# EAGLE design uHexV1_pub (EAGLE 7.2.0)
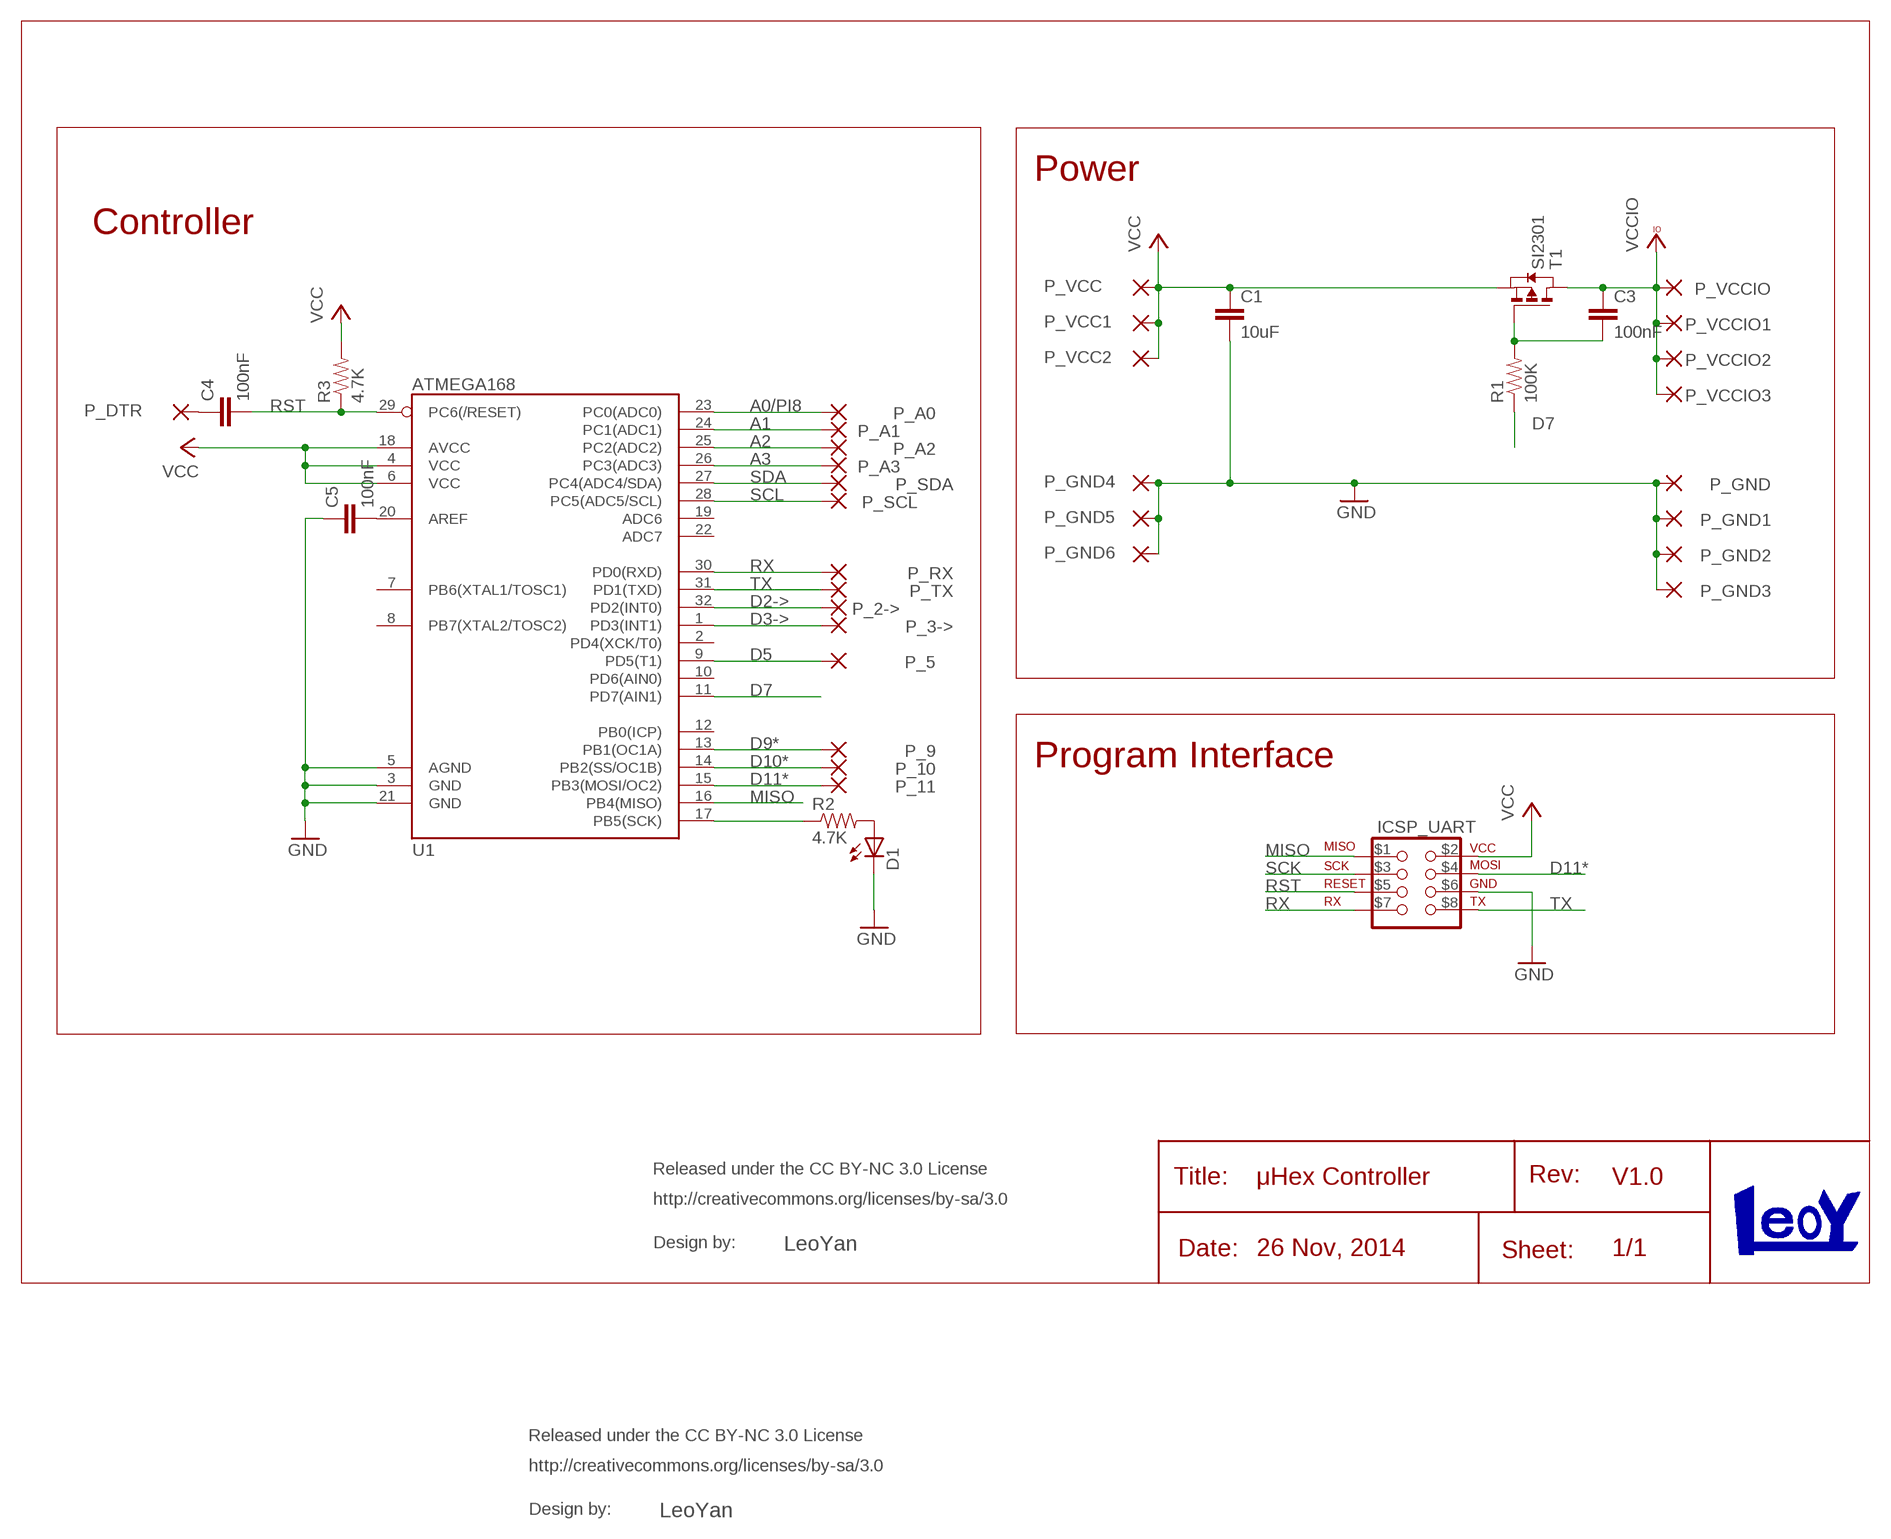
[diagram p0: schematic, sheet 1]

## Parts
C1  10uF  C-EUC0603K  [C0603K]
C3  100nF  C-EUC0603K  [C0603K]
C4  100nF  C-EUC0603K  [C0603K]
C5  100nF  C-EUC0603K  [C0603K]
D1  LED-YELLOW0603  [LED-0603]
ICSP_UART  ICSP_UART_CONNICSP_UAST_HOLE  [ICSP_UART_CONN_HOLE]
P_2->  TH-PAD2.54M01_TH_OFFSET  [TH_PAD_OFFSET]
P_3->  TH-PAD2.54M01_TH_OFFSET  [TH_PAD_OFFSET]
P_5  TH-PAD2.54M01_TH_HORN  [TH_PAD_HORN]
P_9  TH-PAD2.54M01_TH_OFFSET  [TH_PAD_OFFSET]
P_10  TH-PAD2.54M01_TH_OFFSET  [TH_PAD_OFFSET]
P_11  TH-PAD2.54M01_TH_HORN  [TH_PAD_HORN]
P_A0  TH-PAD2.54M01_TH_HORN  [TH_PAD_HORN]
P_A1  TH-PAD2.54M01_TH_OFFSET  [TH_PAD_OFFSET]
P_A2  TH-PAD2.54M01_TH_OFFSET  [TH_PAD_OFFSET]
P_A3  TH-PAD2.54M01_TH_HORN  [TH_PAD_HORN]
P_DTR  TH-PAD2.54MO1_TH_DTR  [TH_PAD_DTR]
P_GND  TH-PAD2.54M01_TH_PWR  [TH_PAD_PWR]
P_GND1  TH-PAD2.54OFFSET  [TH_PAD_PWR_OFFSET]
P_GND2  TH-PAD2.54OFFSET  [TH_PAD_PWR_OFFSET]
P_GND3  TH-PAD2.54OFFSET  [TH_PAD_PWR_OFFSET]
P_GND4  TH-PAD2.54OFFSET  [TH_PAD_PWR_OFFSET]
P_GND5  TH-PAD2.54OFFSET  [TH_PAD_PWR_OFFSET]
P_GND6  TH-PAD2.54OFFSET  [TH_PAD_PWR_OFFSET]
P_RX  TH-PAD2.54M01_TH_OFFSET  [TH_PAD_OFFSET]
P_SCL  TH-PAD2.54M01_TH_OFFSET  [TH_PAD_OFFSET]
P_SDA  TH-PAD2.54M01_TH_OFFSET  [TH_PAD_OFFSET]
P_TX  TH-PAD2.54M01_TH_OFFSET  [TH_PAD_OFFSET]
P_VCC  TH-PAD2.54OFFSET  [TH_PAD_PWR_OFFSET]
P_VCC1  TH-PAD2.54M01_TH_PWR  [TH_PAD_PWR]
P_VCC2  TH-PAD2.54OFFSET  [TH_PAD_PWR_OFFSET]
P_VCCIO  TH-PAD2.54OFFSET  [TH_PAD_PWR_OFFSET]
P_VCCIO1  TH-PAD2.54OFFSET  [TH_PAD_PWR_OFFSET]
P_VCCIO2  TH-PAD2.54OFFSET  [TH_PAD_PWR_OFFSET]
P_VCCIO3  TH-PAD2.54OFFSET  [TH_PAD_PWR_OFFSET]
R1  100K  RESISTOR0603-RES  [0603-RES]
R2  4.7K  RESISTOR0603-RES  [0603-RES]
R3  4.7K  RESISTOR0603-RES  [0603-RES]
T1  SI2301  PMOSSOT23  [SOT-23]
U1  ATMEGA168  [TQFP32-08]

## Nets
A0/PI8: P_A0.1(P$) U1.23(PC0(ADC0))
A1: P_A1.P$1(P$) U1.24(PC1(ADC1))
A2: P_A2.P$1(P$) U1.25(PC2(ADC2))
A3: P_A3.1(P$) U1.26(PC3(ADC3))
D2->: P_2->.P$1(P$) U1.32(PD2(INT0))
D3->: P_3->.P$1(P$) U1.1(PD3(INT1))
D5: P_5.1(P$) U1.9(PD5(T1))
D7: R1.1 U1.11(PD7(AIN1))
D9*: P_9.P$1(P$) U1.13(PB1(OC1A))
D10*: P_10.P$1(P$) U1.14(PB2(SS/OC1B))
D11*: ICSP_UART.$4 P_11.1(P$) U1.15(PB3(MOSI/OC2))
GND [Power]: C1.2 C5.1 D1.C ICSP_UART.$6 P_GND1.P$1(P$) P_GND2.P$1(P$) P_GND3.P$1(P$) P_GND4.P$1(P$) P_GND5.P$1(P$) P_GND6.P$1(P$) P_GND.P$1(P$) U1.3(GND) U1.5(AGND) U1.21(GND)
MISO: ICSP_UART.$1 U1.16(PB4(MISO))
N$1: D1.A R2.2
N$4: C3.2 R1.2 T1.3(G)
N$6: C4.1 P_DTR.1(P$)
N$8: C5.2 U1.20(AREF)
RST: C4.2 ICSP_UART.$5 R3.1 U1.29(PC6(/RESET))
RX: ICSP_UART.$7 P_RX.P$1(P$) U1.30(PD0(RXD))
SCK: ICSP_UART.$3 R2.1 U1.17(PB5(SCK))
SCL: P_SCL.P$1(P$) U1.28(PC5(ADC5/SCL))
SDA: P_SDA.P$1(P$) U1.27(PC4(ADC4/SDA))
TX: ICSP_UART.$8 P_TX.P$1(P$) U1.31(PD1(TXD))
VCC [Power]: C1.1 ICSP_UART.$2 P_VCC1.P$1(P$) P_VCC2.P$1(P$) P_VCC.P$1(P$) R3.2 T1.2(S) U1.4(VCC) U1.6(VCC) U1.18(AVCC)
VCCIO [Power]: C3.1 P_VCCIO1.P$1(P$) P_VCCIO2.P$1(P$) P_VCCIO3.P$1(P$) P_VCCIO.P$1(P$) T1.1(D)
Unconnected: U1.2(PD4(XCK/T0)) U1.7(PB6(XTAL1/TOSC1)) U1.8(PB7(XTAL2/TOSC2)) U1.10(PD6(AIN0)) U1.12(PB0(ICP)) U1.19(ADC6) U1.22(ADC7)

## Notes on the sheet
- Power
- Controller
- Program Interface
- μHex Controller | V1.0
- 26 Nov, 2014 | 1/1

## Library data of the parts
C1 = resistor:C-EU: CAPACITOR, European symbol
C3-C5 = rcl:C-EU: CAPACITOR, European symbol
D1 = SparkFun-LED:LED-YELLOW: Yellow SMD LEDs LilyPad 1206- DIO-09909 0603- DIO-09003; PROD_ID: DIO-09003
ICSP_UART = LeoYan:ICSP_UART_CONN
P_2-> P_3-> P_5 P_9-P_11 P_A0 P_A1-P_A3 P_DTR P_GND P_GND1-P_GND6 P_RX P_SCL P_SDA P_TX P_VCC P_VCC1 P_VCC2 P_VCCIO P_VCCIO1-P_VCCIO3 = LeoBuild:TH-PAD2.54
R1-R3 = SparkFun-Passives:RESISTOR: Resistor Basic schematic elements and footprints for 0603, 1206, and PTH resistors.
T1 = zetex:PMOSSOT23: MOS FET; OC_FARNELL: unknown; OC_NEWARK: unknown
U1 = SparkFun-DigitalIC:ATMEGA168: Atmel 32-pin 8-bit micro, 16k flash.

## Net classes
0 default: width 0.254 mm, drill 0.356 mm, clearance 0.254 mm
1 Power: width 0.406 mm, drill 0.356 mm, clearance 0.305 mm

## Board
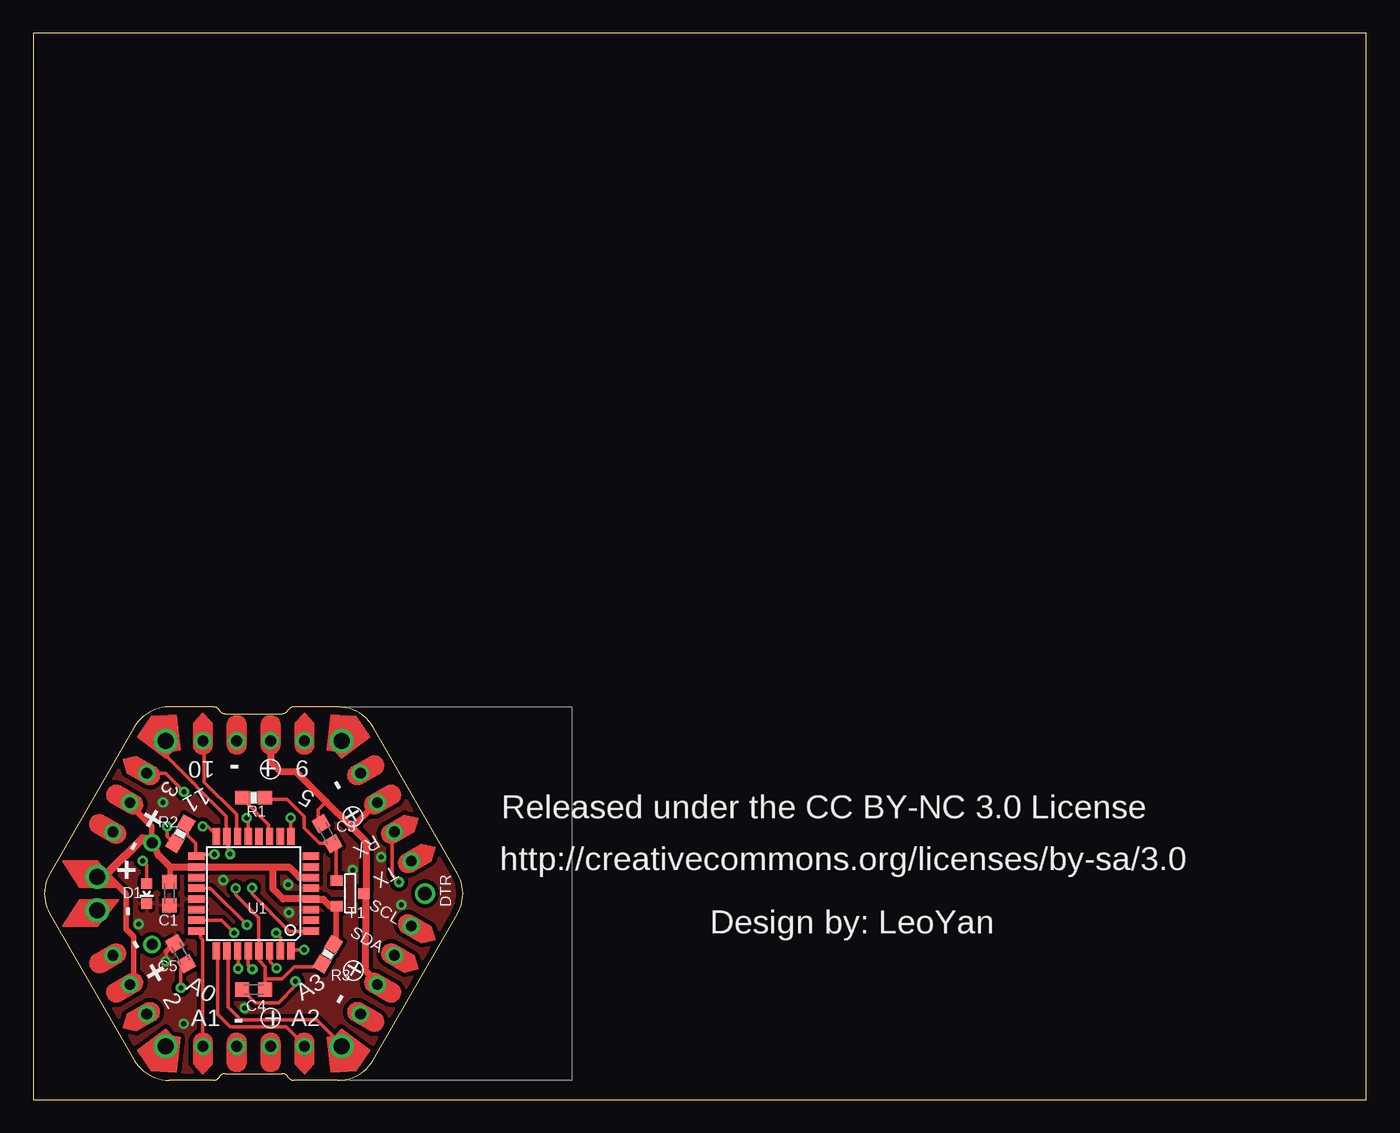
[diagram p1: board, top side]
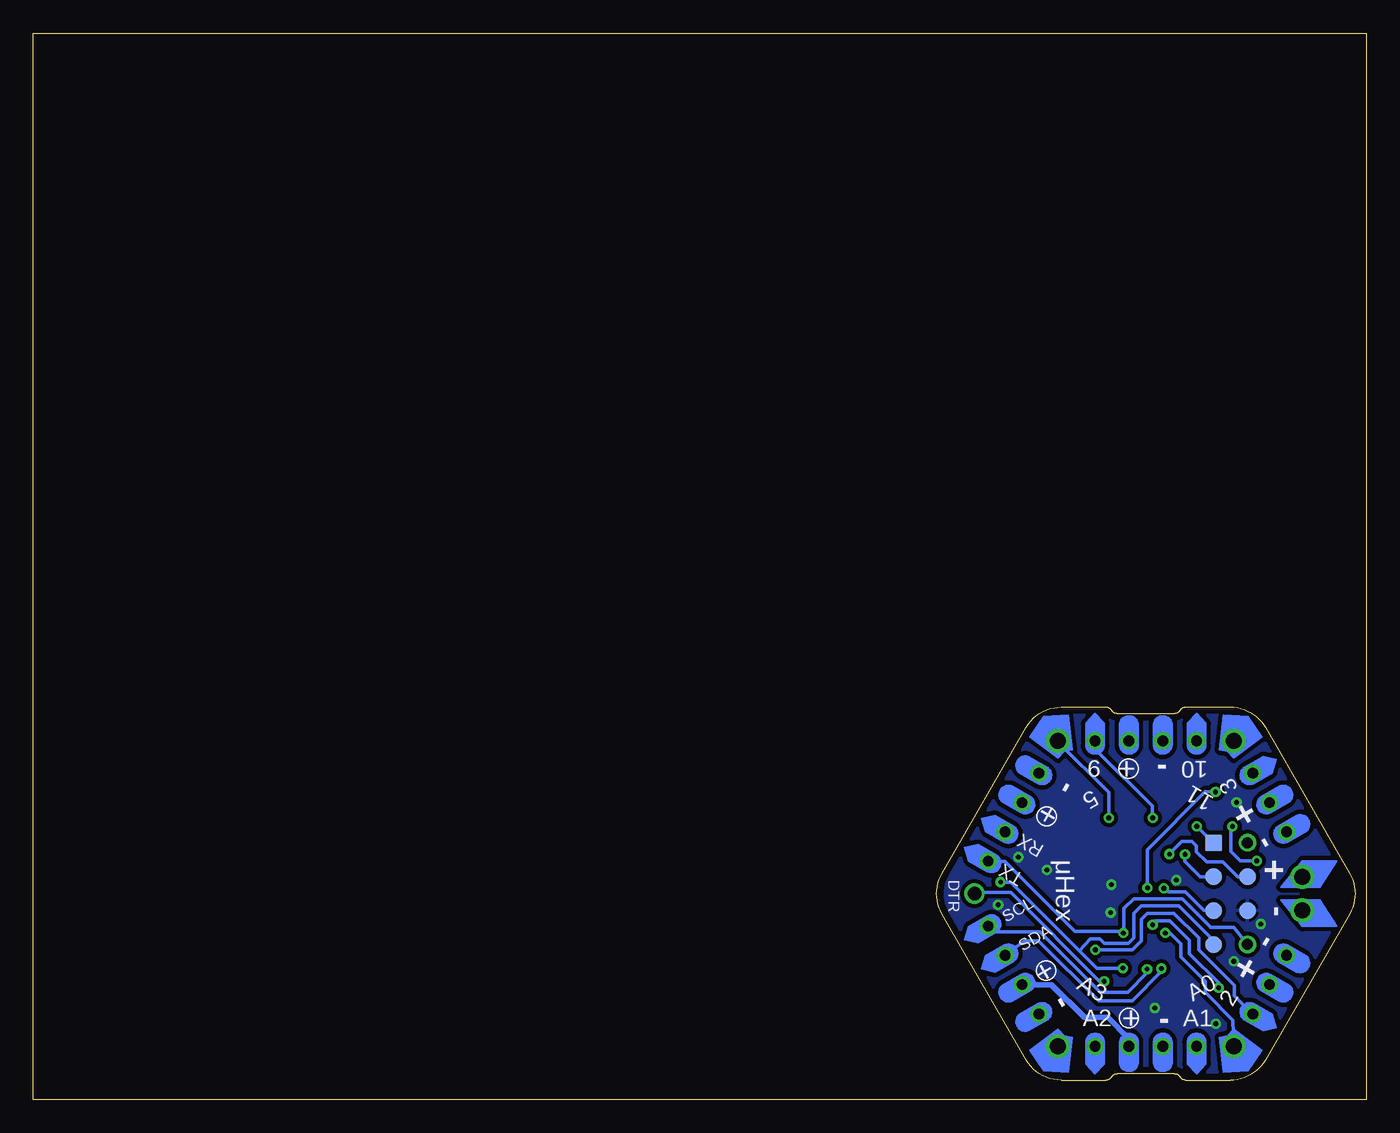
[diagram p2: board, bottom side, seen from below]

Size 100 x 80 mm. Coordinates in mm from the lower left corner, seen from the top.
Outline: 0,0 100,0 100,80 0,80 0,0
Outline: 14.4,28.95 18.66,28.95 arc60 19.1,29.2 arc-60 19.53,29.45 22.88,29.45 arc-60 25.48,27.95 31.83,16.95 arc-60 31.83,13.95 25.48,2.95 arc-60 22.88,1.45 19.53,1.45 arc-60 19.1,1.7 arc60 18.66,1.95 14.4,1.95 arc60 13.96,1.7 arc-60 13.53,1.45 10.18,1.45 arc-60 7.58,2.95 1.23,13.95 arc-60 1.23,16.95 7.58,27.95 arc-60 10.18,29.45 13.53,29.45 arc-60 13.96,29.2 arc60 14.4,28.95
Copper layers (1*16): Top 0.035mm / dielectric 1.5mm / Bottom 0.035mm
Design rules "default *": minimum track width 10mil, minimum drill 14mil, track to track 10mil, track to pad 10mil, pad to pad 10mil, via to via 10mil, smd to smd 10mil, copper to edge 20mil, drill to drill 8mil, minimum pad ring 10mil, minimum via ring 8mil, stop-mask expansion 4mil, vias tented up to drill 16mil, thermal gap 10mil

### Footprints (pad centres in the part's own frame; a part is rotated, then mirrored left to right if it is on the bottom)
C0603K = smd 1.05 x 1.08: 1 -0.875,0; 2 0.875,0
LED-0603 = smd 0.8 x 0.8: A 0,-0.75; C 0,0.75
ICSP_UART_CONN_HOLE = smd 1.27 x 1.27: $1 -1.27,3.81; $3 -1.27,1.27; $4 1.27,1.27; $5 -1.27,-1.27; $6 1.27,-1.27; $7 -1.27,-3.81 | drill 0.8 pad 1.2: $2 1.27,3.81; $8 1.27,-3.81
TH_PAD_OFFSET = drill 0.8: P$1 0,0
TH_PAD_HORN = drill 1.2: 1 0,0
TH_PAD_DTR = drill 1: 1 0,0
TH_PAD_PWR = drill 1.2: P$1 0,0
TH_PAD_PWR_OFFSET = drill 0.8: P$1 0,0
0603-RES = smd 1.1 x 1: 1 -0.85,0; 2 0.85,0
SOT-23 = smd 0.787 x 0.889: 1 0.025,-1.016; 2 -0.94,1.016; 3 0.991,1.016
TQFP32-08 = smd 1.27 x 0.559: 1 -4.293,2.8; 2 -4.293,2; 3 -4.293,1.2; 4 -4.293,0.4; 5 -4.293,-0.4; 6 -4.293,-1.2; 7 -4.293,-2; 8 -4.293,-2.8; 17 4.293,-2.8; 18 4.293,-2; 19 4.293,-1.2; 20 4.293,-0.4; 21 4.293,0.4; 22 4.293,1.2; 23 4.293,2; 24 4.293,2.8 | smd 0.559 x 1.27: 9 -2.8,-4.293; 10 -2,-4.293; 11 -1.2,-4.293; 12 -0.4,-4.293; 13 0.4,-4.293; 14 1.2,-4.293; 15 2,-4.293; 16 2.8,-4.293; 25 2.8,4.293; 26 2,4.293; 27 1.2,4.293; 28 0.4,4.293; 29 -0.4,4.293; 30 -1.2,4.293; 31 -2,4.293; 32 -2.8,4.293

### Placement (x,y rotation side)
C1  10.2,15.45 270 top
C3  22.03,19.95 300 top
C4  16.53,8.25 0 top
C5  11.05,10.95 300 top
D1  8.5,15.46 180 top
ICSP_UART  10.18,15.45 0 bottom
P_2->  8.51,6.42 210 top
P_3->  8.51,24.48 150 top
P_5  23.15,26.91 330 top
P_9  20.34,26.91 90 top
P_10  12.72,26.91 90 top
P_11  9.91,26.91 30 top
P_A0  9.91,3.99 150 top
P_A1  12.72,3.99 270 top
P_A2  20.34,3.99 270 top
P_A3  23.15,3.99 210 top
P_DTR  29.38,15.45 270 top
P_GND  4.79,14.18 90 top
P_GND1  15.26,3.99 270 top
P_GND2  5.97,10.82 210 top
P_GND3  24.55,6.42 330 top
P_GND4  24.55,24.48 30 top
P_GND5  15.26,26.91 90 top
P_GND6  5.97,20.08 150 top
P_RX  27.09,20.08 30 top
P_SCL  28.36,13.02 330 top
P_SDA  27.09,10.82 330 top
P_TX  28.36,17.88 30 top
P_VCC  7.24,8.62 210 top
P_VCC1  4.79,16.72 270 bottom
P_VCC2  7.24,22.28 150 top
P_VCCIO  17.8,3.99 270 top
P_VCCIO1  25.82,8.62 330 top
P_VCCIO2  25.82,22.28 30 top
P_VCCIO3  17.8,26.91 90 top
R1  16.53,22.65 0 top
R2  11.03,19.95 240 top
R3  22.1,10.9 60 top
T1  23.78,15.44 90 top
U1  16.53,15.45 180 top

### Tracks (layer width: path | path; a pad name or v marks a point on that pad's centre or on a via)
A0/PI8  (via drill 0.36)
  Top 0.254: 12.19,13.39 12.19,13.45 U1.23 12.34,13.44 14.12,13.44 v15.06,12.5
  Bottom 0.254: P_A0.1 10.01,5.94 12.06,8.05 12.06,8.87 13.92,10.72 13.92,11.68 14.73,12.5 v15.06,12.5
A1
  Top 0.254: 12.7,12.75 U1.24 12.57,12.5 12.57,12.12 12.7,11.99 12.7,4.12 P_A1.P$1
  Top 0.406: 12.45,12.62 12.32,12.62 U1.24
A2
  Top 0.254: U1.25 13.84,11.1 13.84,6.4 14.78,5.46 18.97,5.46 20.32,4.12 P_A2.P$1
A3
  Top 0.254: U1.26 14.61,11.1 14.61,6.91 15.54,5.97 21.26,5.97 23.11,4.12 P_A3.1
D2->  (via drill 0.36)
  Top 0.254: v20.32,11.23 19.43,11.23 U1.32
  Bottom 0.254: v20.32,11.23 17.55,11.23 16.87,11.91 16.87,13.51 16.41,13.97 14.43,13.97 12.57,12.12 12.57,11.23 9.9,8.55 9.9,7.79 8.53,6.42 P_2->.P$1
D3->  (via drill 0.36)
  Top 0.254: U1.1 20.7,12.62 19.2,12.62 16.41,15.42 v16.41,15.88 | v11.3,23.09 9.91,24.48 P_3->.P$1
  Bottom 0.254: v16.41,15.88 16.41,18.75 12.06,23.11 v11.3,23.09
D5  (via drill 0.36)
  Top 0.254: v19.3,21.13 19.3,19.86 U1.9
  Bottom 0.254: v19.3,21.13 19.3,23.04 23.11,26.85 P_5.1
D7
  Top 0.254: R1.1 15.75,22.53 17.65,20.62 17.65,19.86 U1.11
D9*  (via drill 0.36)
  Top 0.254: v16,21.13 16.13,21.01 16.13,19.86 U1.13
  Bottom 0.254: 20.32,26.85 P_9.P$1 20.17,26.73 20.17,26.14 16.05,22.02 16.05,21.18 v16,21.13
D10*
  Top 0.254: U1.14 15.24,19.86 15.24,21.39 12.83,23.8 12.83,26.85 P_10.P$1
D11*  (via drill 0.36)
  Top 0.254: P_11.1 10.03,26.85 10.03,25.7 14.48,21.26 14.48,19.86 U1.15 14.61,19.74 14.61,18.57 v14.76,18.41
  Bottom 0.254: 9.02,17.2 ICSP_UART.$4 9.63,16.72 10.74,17.83 11.94,17.83 12.72,18.59 12.72,19.05 13.08,19.38 13.82,19.38 v14.76,18.41
GND  (via drill 0.36)
  Top 0.254: 9.96,10.41 9.96,11.12
  Top 0.406: 9.96,11.12 10.31,11.48
  other vias: 9.93,10.36 11.28,5.69 19.18,14.02 9.73,22.3 23.95,17.22 14.25,16.46 26.09,18.19 27.61,14.61 15.87,6.86 19.13,16.13 7.9,13.16
  pour Top: 32.13,29.39 0.89,29.39 0.89,1.45 32.26,1.45
  pour Bottom: 32,29.51 0.89,29.39 1.02,1.45 32.26,1.57
MISO  (via drill 0.36)
  Top 0.254: v12.7,20.5 13.08,20.5 13.72,19.86 U1.16
  Bottom 0.254: v12.7,20.5 11.94,19.74 11.56,19.74 ICSP_UART.$1
N$1  (via drill 0.36)
  Top 0.254: v10.03,20.5 10.03,19.74 10.54,19.23 R2.2 | D1.A 8.5,17.62 v8.21,17.91
  Bottom 0.254: v10.03,20.5 10.16,20.37 10.16,18.62 9.45,17.91 v8.21,17.91
N$4
  Top 0.254: T1.3 22.73,16.43 22.73,18.85 22.48,19.1 C3.2 22.35,19.23 21.46,19.23 20.32,20.37 20.32,21.26 19.05,22.53 17.4,22.53 R1.2
N$6  (via drill 0.36)
  Top 0.254: C4.1 15.68,8.25 16.66,7.26 18.39,7.26 19.66,8.53 v19.66,8.87
  Bottom 0.254: P_DTR.1 29.34,15.54 26.67,15.54 19.96,8.84 v19.66,8.87
N$8  (via drill 0.36)
  Top 0.254: U1.20 13.28,15.85 v16.03,13.11 | C5.2 11.07,9.78 v11.07,8.38
  Bottom 0.254: v16.03,13.11 arc90 15.72,13.41 14.73,13.41 13.26,11.94 13.26,10.92 11.07,8.74 v11.07,8.38
RST  (via drill 0.36)
  Top 0.254: 17.4,9.07 17.4,9.96 16.89,10.46 16.89,11.1 U1.29 16.94,11.28 16.94,11.86 16.92,11.89 16.92,13.61 15.19,15.34 v15.19,15.85 | 17.4,9.07 17.4,8.31 C4.2 | 17.4,9.07 18.67,9.07 19.56,9.96 21.47,9.96 arc90 R3.1
  Bottom 0.254: v15.19,15.85 14.86,15.57 13.56,15.57 12.17,14.18 ICSP_UART.$5
RX  (via drill 0.36)
  Top 0.254: v18.26,9.86 17.78,10.34 17.78,11.1 U1.30 | v27.43,16.31 26.91,16.85 26.91,19.9 P_RX.P$1 27.09,19.93
  Bottom 0.254: 21.53,11.16 20.22,9.86 v18.26,9.86 | ICSP_UART.$7 11.56,12.12 11.66,12.12 14.07,14.53 16.87,14.53 17.42,13.97 17.42,12.14 17.83,11.73 19.66,11.73 19.99,12.06 20.68,12.06 21.53,11.16 | 21.53,11.16 26.67,16.31 v27.43,16.31
SCK  (via drill 0.36)
  Top 0.254: R2.1 11.56,20.62 11.56,19.86 12.19,19.23 12.19,18.34 U1.17 12.32,18.34 v13.59,18.39
  Bottom 0.254: 11.56,17.2 ICSP_UART.$3 12.45,16.71 13.59,17.86 v13.59,18.39
SCL  (via drill 0.36)
  Top 0.254: v16.43,9.78 16.13,10.08 16.13,11.1 U1.28
  Bottom 0.254: P_SCL.P$1 27.78,12.59 24.48,12.59 19.94,8.05 17.88,8.05 16.43,9.55 v16.43,9.78
SDA  (via drill 0.36)
  Top 0.254: v15.37,9.83 15.37,11.1 U1.27
  Bottom 0.254: P_SDA.P$1 25.63,11.91 24.59,11.91 20.07,7.42 17.55,7.42 15.37,9.6 v15.37,9.83
TX  (via drill 0.36)
  Top 0.254: 18.54,11.23 U1.31 18.54,11.35 18.54,12.12 v18.21,12.5
  Bottom 0.254: ICSP_UART.$8 9.91,12.9 10.29,12.93 11.68,12.93 11.68,12.95 13.79,15.06 17.45,15.06 18.19,14.33 18.19,12.78 18.34,12.62 | P_TX.P$1 27.1,17.88 21.84,12.62 18.34,12.62 | 18.34,12.62 v18.21,12.5
VCC
  Top 0.406: 20.93,15.04 U1.4 20.7,15.04 | 22.61,14.53 T1.2 22.73,14.4 22.73,11.84 R3.2 | 12.19,17.45 U1.18 12.32,17.45 | P_VCC1.P$1 5.33,17.07 6.99,15.42 6.99,12.75 7.54,12.19 7.54,8.81 7.3,8.62 P_VCC.P$1 | 7.26,22.28 P_VCC2.P$1 7.32,22.07 8.71,20.68 8.87,20.55 8.87,19.94 ICSP_UART.$2 | 10.41,16.54 10.26,16.69 10.26,17.45
  Top 0.508: U1.18 10.26,17.45 9.4,18.31 9.4,18.34 ICSP_UART.$2 8.91,19.59 8.89,19.61 | 12.32,17.45 17.96,17.45 | 17.96,17.45 19.18,17.45 19.96,16.66 20.81,16.66 U1.6 | U1.4 18.73,15.05 17.98,15.8 17.98,17.42 17.96,17.45 | 20.93,15.04 21.75,15.04 22.25,14.5 T1.2 | 10.41,16.54 C1.1
  Top 0.559: U1.18
  Top 0.61: 8.89,19.61 8.2,19.61 5.59,16.99 P_VCC1.P$1
VCCIO
  Top 0.254: 21.72,20.75 21.39,21.03 arc-90 21.36,21.06 21.36,21.72 21.98,22.34
  Top 0.406: 21.72,20.75 C3.1 | P_VCCIO2.P$1 25.78,22.28 24.03,20.52 23.8,20.52 | 17.91,26.85 P_VCCIO3.P$1 | 24.99,15.6 T1.1 24.99,15.37 24.92,15.37 | 25.82,8.77 P_VCCIO1.P$1
  Top 0.508: 24.99,15.6 24.99,19.33 23.8,20.52 21.98,22.34 19.74,24.59 18.57,24.59 17.83,25.3 17.8,26.52 P_VCCIO3.P$1 | 24.92,15.37 24.89,9.7 25.82,8.77
  Bottom 0.406: P_VCCIO1.P$1 25.82,8.6 23.63,8.6 21.16,6.16 19.39,6.16 17.8,4.57 P_VCCIO.P$1

### Text on the board
tPlace: 10 | - | + | 9 | - | 3 | 5 | 11 | + | + | - | RX | Released under the CC BY-NC 3.0 License | + | TX | http://creativecommons.org/licenses/by-sa/3.0 | - | SCL | DTR | - | SDA | Design by: LeoYan | + | + | A0 | A3 | - | 2 | A1 | - | + | A2
bPlace: 10 | - | + | 9 | 3 | - | 11 | 5 | + | + | - | RX | μHex | + | TX | DTR | - | SCL | - | SDA | + | + | 2 | A0 | A3 | - | A1 | - | + | A2